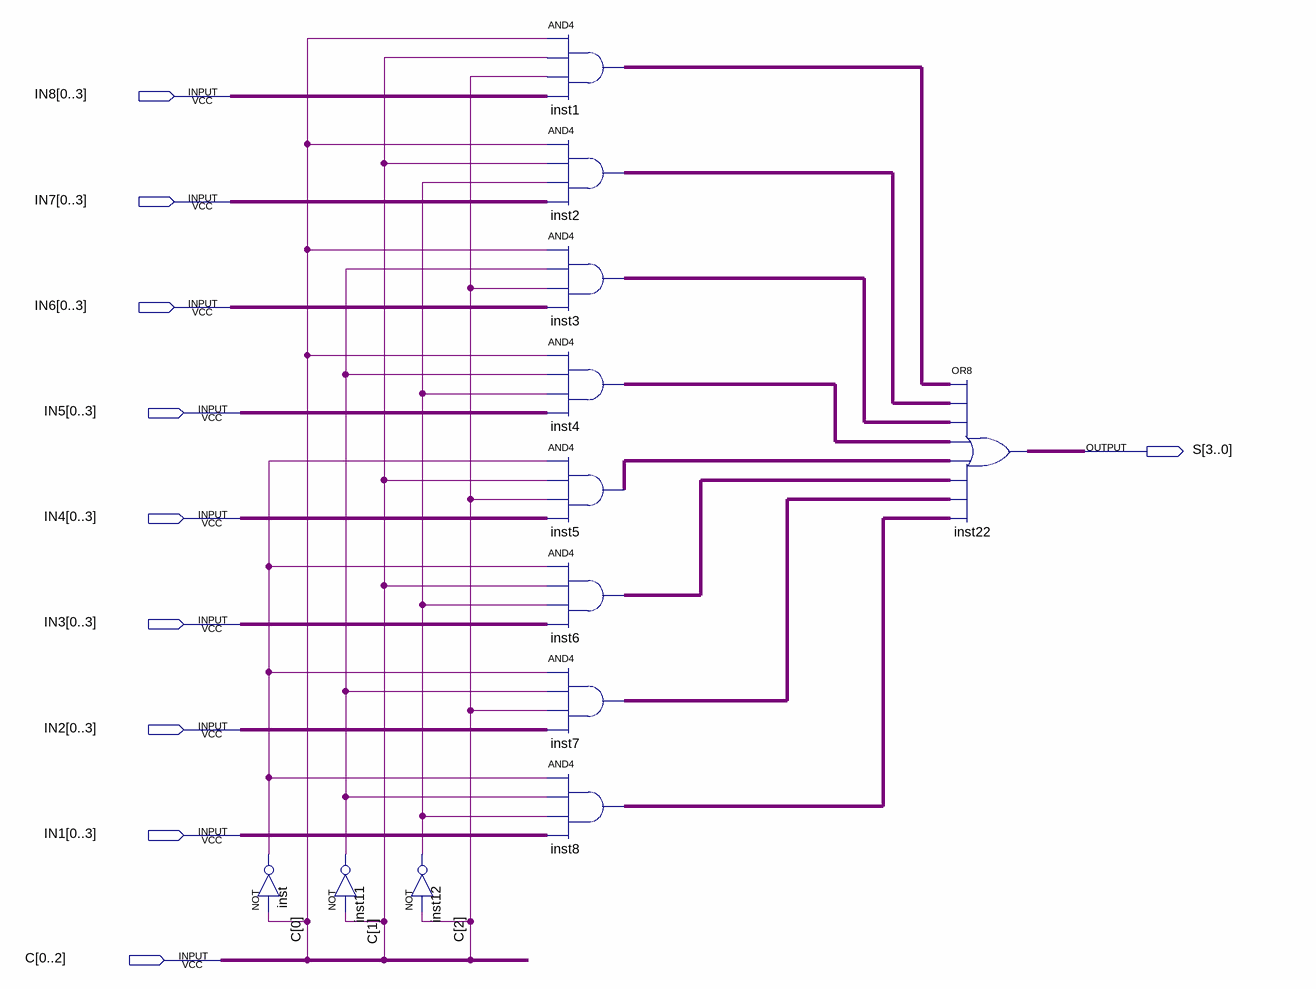
[diagram p0: schematic sheet]
// Quartus schematic Mux4.bdf as structural Verilog: 12 symbols, 10 pins
module Mux4 (
  input  [0:3] IN8,
  input  [0:3] IN7,
  input  [0:3] IN6,
  input  [0:3] IN5,
  input  [0:3] IN4,
  input  [0:3] IN3,
  input  [0:3] IN2,
  input  [0:3] IN1,
  input  [0:2] C,
  output [3:0] S
);

  wire inst11_out, inst12_out, inst_out;
  wire [3:0] inst1_out, inst2_out, inst3_out, inst4_out, inst5_out, inst6_out, inst7_out, inst8_out;

  not inst (inst_out, C[0]);
  not inst11 (inst11_out, C[1]);
  not inst12 (inst12_out, C[2]);
  assign inst1_out = {4{C[0]}} & {4{C[1]}} & {4{C[2]}} & IN8;  // AND4 inst1, 4 bits wide
  assign inst2_out = {4{C[0]}} & {4{C[1]}} & {4{inst12_out}} & IN7;  // AND4 inst2, 4 bits wide
  assign inst3_out = {4{C[0]}} & {4{inst11_out}} & {4{C[2]}} & IN6;  // AND4 inst3, 4 bits wide
  assign inst4_out = {4{C[0]}} & {4{inst11_out}} & {4{inst12_out}} & IN5;  // AND4 inst4, 4 bits wide
  assign inst5_out = {4{inst_out}} & {4{C[1]}} & {4{C[2]}} & IN4;  // AND4 inst5, 4 bits wide
  assign inst6_out = {4{inst_out}} & {4{C[1]}} & {4{inst12_out}} & IN3;  // AND4 inst6, 4 bits wide
  assign inst7_out = {4{inst_out}} & {4{inst11_out}} & {4{C[2]}} & IN2;  // AND4 inst7, 4 bits wide
  assign inst8_out = {4{inst_out}} & {4{inst11_out}} & {4{inst12_out}} & IN1;  // AND4 inst8, 4 bits wide
  assign S = inst1_out | inst2_out | inst3_out | inst4_out | inst5_out | inst6_out | inst7_out | inst8_out;  // OR8 inst22, 4 bits wide
endmodule
